# Altium schematic sheet E_STOP_&_HIGH_CURRENT_GATE_DRIVE.SchDoc
size A
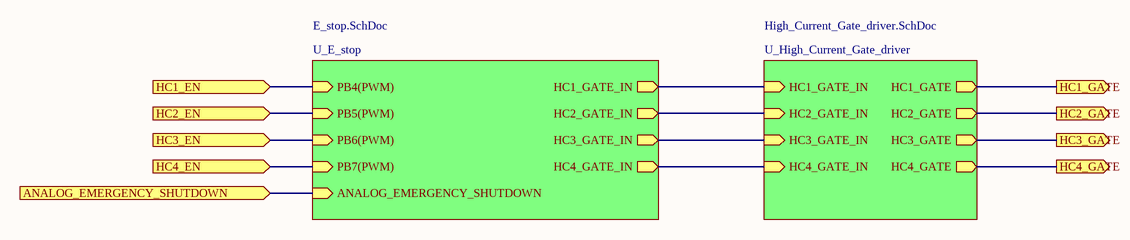
[diagram p0: E_STOP_&_HIGH_CURRENT_GATE_DRIVE.SchDoc]

## Sub-sheets
U_E_stop = E_stop.SchDoc: HC1_GATE_IN (out), HC2_GATE_IN (out), HC3_GATE_IN (out), HC4_GATE_IN (out), PB4(PWM) (in), PB5(PWM) (in), PB6(PWM) (in), PB7(PWM) (in), ANALOG_EMERGENCY_SHUTDOWN (in)
U_High_Current_Gate_driver = High_Current_Gate_driver.SchDoc: HC1_GATE (out), HC2_GATE (out), HC3_GATE (out), HC4_GATE (out), HC1_GATE_IN (in), HC2_GATE_IN (in), HC3_GATE_IN (in), HC4_GATE_IN (in)

## Ports
ANALOG_EMERGENCY_SHUTDOWN (in), HC1_EN (in), HC1_GATE (out), HC2_EN (in), HC2_GATE (out), HC3_EN (in), HC3_GATE (out), HC4_EN (in), HC4_GATE (out)

## Nets
ANALOG_EMERGENCY_SHUTDOWN: port ANALOG_EMERGENCY_SHUTDOWN, sheet U_E_stop/ANALOG_EMERGENCY_SHUTDOWN
HC1_EN: port HC1_EN, sheet U_E_stop/PB4(PWM)
HC1_GATE: port HC1_GATE, sheet U_High_Current_Gate_driver/HC1_GATE
HC2_EN: port HC2_EN, sheet U_E_stop/PB5(PWM)
HC2_GATE: port HC2_GATE, sheet U_High_Current_Gate_driver/HC2_GATE
HC3_EN: port HC3_EN, sheet U_E_stop/PB6(PWM)
HC3_GATE: port HC3_GATE, sheet U_High_Current_Gate_driver/HC3_GATE
HC4_EN: port HC4_EN, sheet U_E_stop/PB7(PWM)
HC4_GATE: port HC4_GATE, sheet U_High_Current_Gate_driver/HC4_GATE
(unnamed): sheet U_E_stop/HC1_GATE_IN, sheet U_High_Current_Gate_driver/HC1_GATE_IN
(unnamed): sheet U_E_stop/HC2_GATE_IN, sheet U_High_Current_Gate_driver/HC2_GATE_IN
(unnamed): sheet U_E_stop/HC3_GATE_IN, sheet U_High_Current_Gate_driver/HC3_GATE_IN
(unnamed): sheet U_E_stop/HC4_GATE_IN, sheet U_High_Current_Gate_driver/HC4_GATE_IN